# Altium schematic sheet Barrido2fuentes.SchDoc
size A4; SheetNumber: 7; SheetTotal: 7
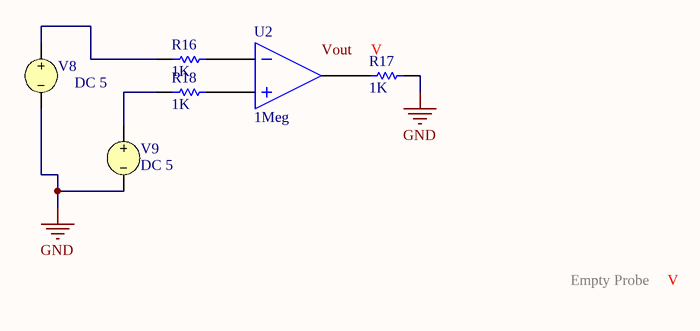
[diagram p0: Barrido2fuentes.SchDoc]

## Parts
R16  value 1K  (hidden comment: Resistor)
R17  value 1K  (hidden comment: Resistor)
R18  value 1K  (hidden comment: Resistor)
U2  GAIN: 1Meg  (hidden comment: Ideal Operational Amplifier)
V8  DC 5
V9  DC 5

## Nets
GND: R17.2 V8.2 V9.2
NetR16_1: R16.1 V8.1
NetR16_2: R16.2 U2.1(IN-)
NetR17_1: R17.1 U2.3(OUT)
NetR18_1: R18.1 V9.1
NetR18_2: R18.2 U2.2(IN+)

## Notes on the sheet
- Labels drawn without touching a wire or pin: Vout

## Library data of the parts
R16-R18 = Resistor: TC1: 0; SimulationGenericComponent: True; TC2: 0
U2 = OpAmp: SimulationGenericComponent: True
V8 V9 = VSRC: Voltage Source; Note: PCB Footprint - Not required; AC Magnitude: 1; AC Phase: 0; Value: 5; Published: 8-Jun-2000; LatestRevisionDate: 17-Jul-2002; LatestRevisionNote: Re-released for DXP Platform.; PackageReference: Not Applicable; Publisher: Altium Limited